# EAGLE design Firefly-Box (EAGLE 6.6.0)

## Sheet 1 of 3
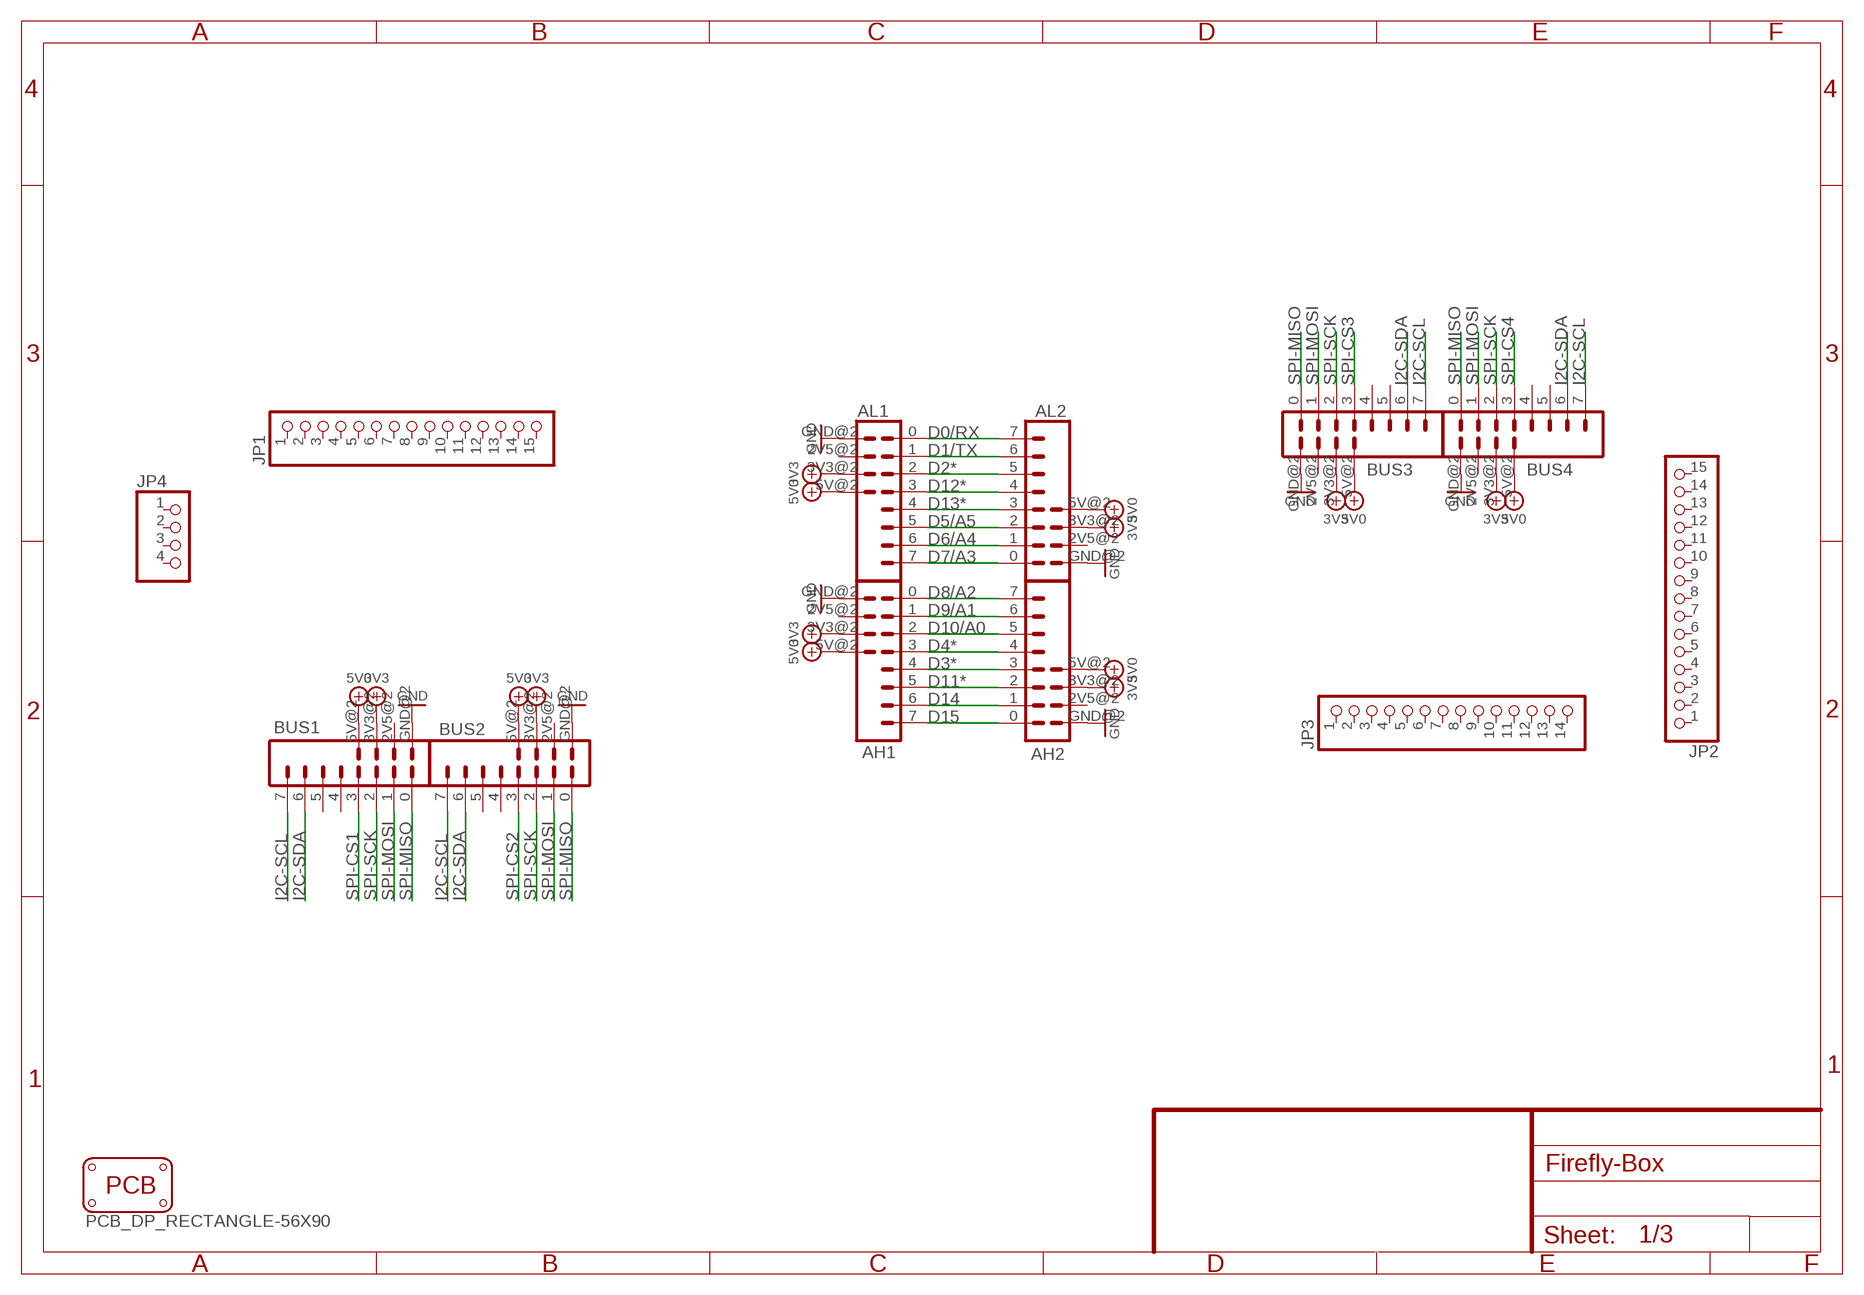
[diagram p0: schematic, sheet 1]

### Parts
AH1  WING8WING8_NOHOLES  [WINGSIDE_8BIT_NOHOLES]
AH2  WING8WING8_NOHOLES  [WINGSIDE_8BIT_NOHOLES]
AL1  WING8WING8_NOHOLES  [WINGSIDE_8BIT_NOHOLES]
AL2  WING8WING8_NOHOLES  [WINGSIDE_8BIT_NOHOLES]
BUS1  WING8WING8_NOHOLES  [WINGSIDE_8BIT_NOHOLES]
BUS2  WING8WING8_NOHOLES  [WINGSIDE_8BIT_NOHOLES]
BUS3  WING8WING8_NOHOLES  [WINGSIDE_8BIT_NOHOLES]
BUS4  WING8WING8_NOHOLES  [WINGSIDE_8BIT_NOHOLES]
JP1  PINHD-1X15  [1X15]
JP2  PINHD-1X15  [1X15]
JP3  PINHD-1X14  [1X14]
JP4  PINHD-1X4  [1X04]
PCB2  PCB_DP_RECTANGLE-56X90  [DP9056_V1]

### Nets
3V3: AH1.3V3@2(3V3) AH2.3V3@2(3V3) AL1.3V3@2(3V3) AL2.3V3@2(3V3) BUS1.3V3@2(3V3) BUS2.3V3@2(3V3) BUS3.3V3@2(3V3) BUS4.3V3@2(3V3) ; also sheet 2,3
5V0: AH1.5V@2(5V) AH2.5V@2(5V) AL1.5V@2(5V) AL2.5V@2(5V) BUS1.5V@2(5V) BUS2.5V@2(5V) BUS3.5V@2(5V) BUS4.5V@2(5V) ; also sheet 2,3
D0/RX: AL1.0 AL2.7 ; also sheet 2
D1/TX: AL1.1 AL2.6 ; also sheet 2
D2*: AL1.2 AL2.5 ; also sheet 2
D3*: AH1.4 AH2.3 ; also sheet 2
D4*: AH1.3 AH2.4 ; also sheet 2
D5/A5: AL1.5 AL2.2 ; also sheet 2
D6/A4: AL1.6 AL2.1 ; also sheet 2
D7/A3: AL1.7 AL2.0 ; also sheet 2
D8/A2: AH1.0 AH2.7 ; also sheet 2
D9/A1: AH1.1 AH2.6 ; also sheet 2
D10/A0: AH1.2 AH2.5 ; also sheet 2
D11*: AH1.5 AH2.2 ; also sheet 2
D12*: AL1.3 AL2.4 ; also sheet 2
D13*: AL1.4 AL2.3 ; also sheet 2
D14: AH1.6 AH2.1 ; also sheet 2
D15: AH1.7 AH2.0 ; also sheet 2
GND [gnd]: AH1.GND@2(GND) AH2.GND@2(GND) AL1.GND@2(GND) AL2.GND@2(GND) BUS1.GND@2(GND) BUS2.GND@2(GND) BUS3.GND@2(GND) BUS4.GND@2(GND) ; also sheet 2,3
I2C-SCL: BUS1.7 BUS2.7 BUS3.7 BUS4.7 ; also sheet 2
I2C-SDA: BUS1.6 BUS2.6 BUS3.6 BUS4.6 ; also sheet 2
SPI-CS1: BUS1.3 ; also sheet 2
SPI-CS2: BUS2.3 ; also sheet 2
SPI-CS3: BUS3.3 ; also sheet 2
SPI-CS4: BUS4.3 ; also sheet 2
SPI-MISO: BUS1.0 BUS2.0 BUS3.0 BUS4.0 ; also sheet 2
SPI-MOSI: BUS1.1 BUS2.1 BUS3.1 BUS4.1 ; also sheet 2
SPI-SCK: BUS1.2 BUS2.2 BUS3.2 BUS4.2 ; also sheet 2
Unconnected: AH1.2V5@2(2V5) AH2.2V5@2(2V5) AL1.2V5@2(2V5) AL2.2V5@2(2V5) BUS1.2V5@2(2V5) BUS1.4 BUS1.5 BUS2.2V5@2(2V5) BUS2.4 BUS2.5 BUS3.2V5@2(2V5) BUS3.4 BUS3.5 BUS4.2V5@2(2V5) BUS4.4 BUS4.5 JP1.1 JP1.2 JP1.3 JP1.4 JP1.5 JP1.6 JP1.7 JP1.8 JP1.9 JP1.10 JP1.11 JP1.12 JP1.13 JP1.14 JP1.15 JP2.1 JP2.2 JP2.3 JP2.4 JP2.5 JP2.6 JP2.7 JP2.8 JP2.9 JP2.10 JP2.11 JP2.12 JP2.13 JP2.14 JP2.15 JP3.1 JP3.2 JP3.3 JP3.4 JP3.5 JP3.6 JP3.7 JP3.8 JP3.9 JP3.10 JP3.11 JP3.12 JP3.13 JP3.14 JP4.1 JP4.2 JP4.3 JP4.4

## Sheet 2 of 3
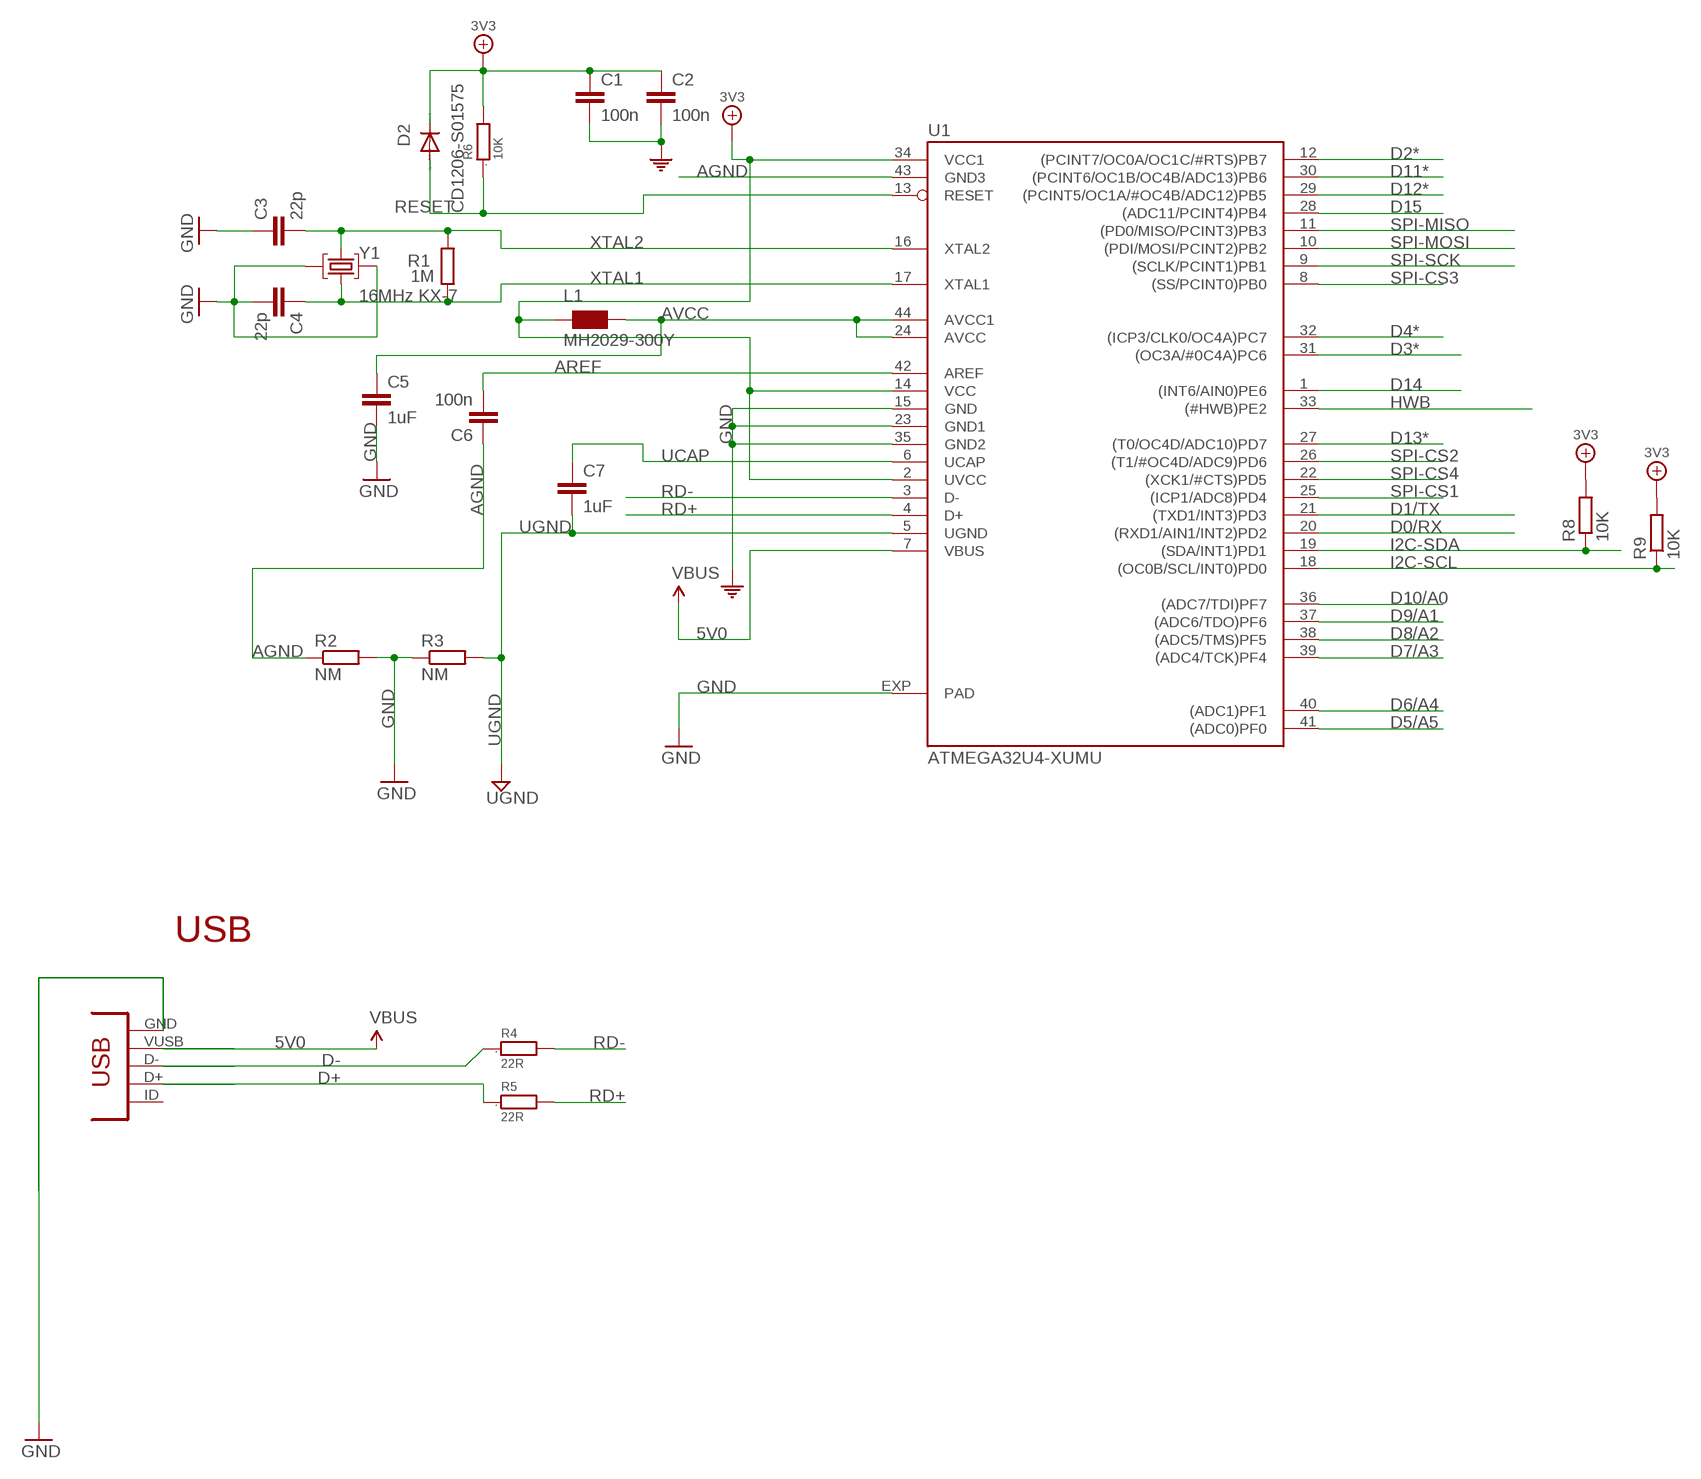
[diagram p1: schematic, sheet 2, part 1 of 2]
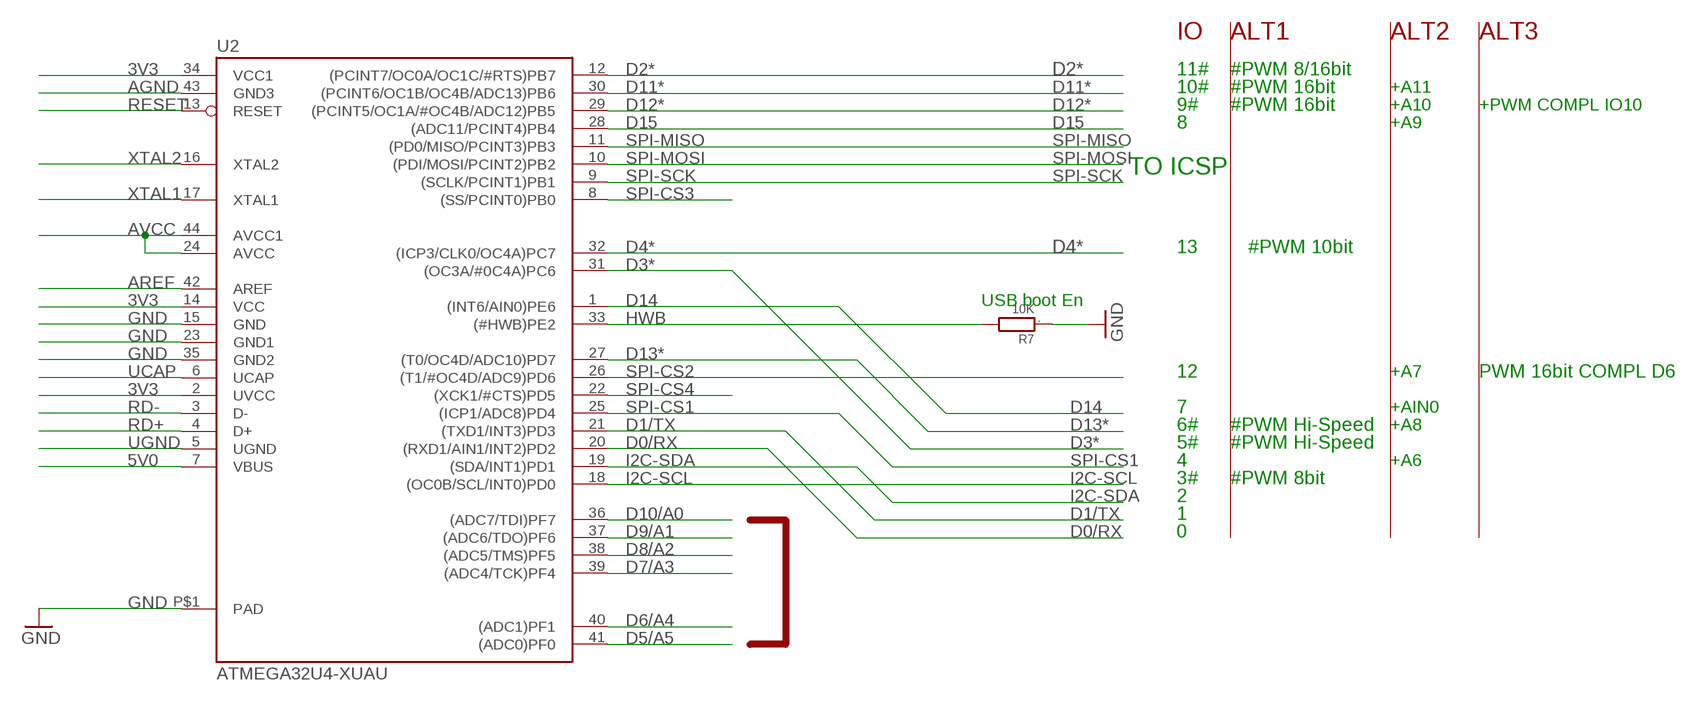
[diagram p2: schematic, sheet 2, part 2 of 2]

### Parts
C1  100n  C-EUC0603  [C0603-ROUND]
C2  100n  C-EUC0603  [C0603-ROUND]
C3  22p  C-EUC0603  [C0603-ROUND]
C4  22p  C-EUC0603  [C0603-ROUND]
C5  1uF  C-EUC0603  [C0603-ROUND]
C6  100n  C-EUC0603  [C0603-ROUND]
C7  1uF  C-EUC0603  [C0603-ROUND]
CONN2  CONN_USB  [CONN_USB_MINI-B]
D2  CD1206-S01575  DIODE-MINIMELF  [MINIMELF]
L1  MH2029-300Y  WE-CBF_0805  [0805]
R1  1M  R-EU_R0603  [R0603-ROUND]
R2  NM  R-EU_R0402  [R0402]
R3  NM  R-EU_R0402  [R0402]
R4  22R  R0805  [0805]
R5  22R  R0805  [0805]
R6  10K  R0805  [0805]
R7  10K  R0805  [0805]
R8  10K  R-EU_R0402  [R0402]
R9  10K  R-EU_R0402  [R0402]
U1  ATMEGA32U4-XUMU  [QFN44ML7X7]
U2  ATMEGA32U4-XUAU  [TQFP44-PAD]
Y1  16MHz KX-7  CRYSTAL-3.2-2.5  [CRYSTAL-3.2-2.5]

### Nets
3V3: C1.1 C2.1 D2.C L1.1 R6.2 R8.2 R9.2 U1.2(UVCC) U1.14(VCC) U1.34(VCC1) U2.2(UVCC) U2.14(VCC) U2.34(VCC1) ; also sheet 1,3
5V0: CONN2.VUSB U1.7(VBUS) U2.7(VBUS) ; supply symbol labelled VBUS ; also sheet 1,3
AGND: C6.1 R2.1 U1.43(GND3) U2.43(GND3)
AREF [aref]: C6.2 U1.42(AREF) U2.42(AREF)
AVCC: C5.1 L1.2 U1.24(AVCC) U1.44(AVCC1) U2.24(AVCC) U2.44(AVCC1)
D0/RX: U1.20((RXD1/AIN1/INT2)PD2) U2.20((RXD1/AIN1/INT2)PD2) ; also sheet 1
D1/TX: U1.21((TXD1/INT3)PD3) U2.21((TXD1/INT3)PD3) ; also sheet 1
D2*: U1.12((PCINT7/OC0A/OC1C/#RTS)PB7) U2.12((PCINT7/OC0A/OC1C/#RTS)PB7) ; also sheet 1
D3*: U1.31((OC3A/#0C4A)PC6) U2.31((OC3A/#0C4A)PC6) ; also sheet 1
D4*: U1.32((ICP3/CLK0/OC4A)PC7) U2.32((ICP3/CLK0/OC4A)PC7) ; also sheet 1
D5/A5: U1.41((ADC0)PF0) U2.41((ADC0)PF0) ; also sheet 1
D6/A4: U1.40((ADC1)PF1) U2.40((ADC1)PF1) ; also sheet 1
D7/A3: U1.39((ADC4/TCK)PF4) U2.39((ADC4/TCK)PF4) ; also sheet 1
D8/A2: U1.38((ADC5/TMS)PF5) U2.38((ADC5/TMS)PF5) ; also sheet 1
D9/A1: U1.37((ADC6/TDO)PF6) U2.37((ADC6/TDO)PF6) ; also sheet 1
D10/A0: U1.36((ADC7/TDI)PF7) U2.36((ADC7/TDI)PF7) ; also sheet 1
D11*: U1.30((PCINT6/OC1B/OC4B/ADC13)PB6) U2.30((PCINT6/OC1B/OC4B/ADC13)PB6) ; also sheet 1
D12*: U1.29((PCINT5/OC1A/#OC4B/ADC12)PB5) U2.29((PCINT5/OC1A/#OC4B/ADC12)PB5) ; also sheet 1
D13*: U1.27((T0/OC4D/ADC10)PD7) U2.27((T0/OC4D/ADC10)PD7) ; also sheet 1
D14: U1.1((INT6/AIN0)PE6) U2.1((INT6/AIN0)PE6) ; also sheet 1
D15: U1.28((ADC11/PCINT4)PB4) U2.28((ADC11/PCINT4)PB4) ; also sheet 1
D+: CONN2.D+ R5.1
D-: CONN2.D- R4.1
GND [gnd]: C1.2 C2.2 C3.1 C4.2 C5.2 CONN2.GND R2.2 R3.1 R7.1 U1.15(GND) U1.23(GND1) U1.35(GND2) U1.EXP(PAD) U2.15(GND) U2.23(GND1) U2.35(GND2) U2.P$1(PAD) Y1.2(GND) Y1.4(GND) ; supply symbol labelled COM ; also sheet 1,3
HWB: R7.2 U1.33((#HWB)PE2) U2.33((#HWB)PE2)
I2C-SCL: R9.1 U1.18((OC0B/SCL/INT0)PD0) U2.18((OC0B/SCL/INT0)PD0) ; also sheet 1
I2C-SDA: R8.1 U1.19((SDA/INT1)PD1) U2.19((SDA/INT1)PD1) ; also sheet 1
RD+: R5.2 U1.4(D+) U2.4(D+)
RD-: R4.2 U1.3(D-) U2.3(D-)
RESET: D2.A R6.1 U1.13(RESET) U2.13(RESET)
SPI-CS1: U1.25((ICP1/ADC8)PD4) U2.25((ICP1/ADC8)PD4) ; also sheet 1
SPI-CS2: U1.26((T1/#OC4D/ADC9)PD6) U2.26((T1/#OC4D/ADC9)PD6) ; also sheet 1
SPI-CS3: U1.8((SS/PCINT0)PB0) U2.8((SS/PCINT0)PB0) ; also sheet 1
SPI-CS4: U1.22((XCK1/#CTS)PD5) U2.22((XCK1/#CTS)PD5) ; also sheet 1
SPI-MISO: U1.11((PD0/MISO/PCINT3)PB3) U2.11((PD0/MISO/PCINT3)PB3) ; also sheet 1
SPI-MOSI: U1.10((PDI/MOSI/PCINT2)PB2) U2.10((PDI/MOSI/PCINT2)PB2) ; also sheet 1
SPI-SCK: U1.9((SCLK/PCINT1)PB1) U2.9((SCLK/PCINT1)PB1) ; also sheet 1
UCAP: C7.1 U1.6(UCAP) U2.6(UCAP)
UGND [gnd]: C7.2 R3.2 U1.5(UGND) U2.5(UGND)
XTAL1: C4.1 R1.1 U1.17(XTAL1) U2.17(XTAL1) Y1.1(C1)
XTAL2: C3.2 R1.2 U1.16(XTAL2) U2.16(XTAL2) Y1.3(C2)
Unconnected: CONN2.BODY@1(BODY) CONN2.BODY@2(BODY) CONN2.BODY@3(BODY) CONN2.BODY@4(BODY) CONN2.ID(USBID)

### Notes on the sheet
- IO | ALT1 | ALT2 | ALT3
- 11# | #PWM 8/16bit
- 10# | #PWM 16bit | +A11
- 9# | #PWM 16bit | +A10 | +PWM COMPL IO10
- 8 | +A9
- TO ICSP
- 13 | #PWM 10bit
- USB boot En
- 12 | +A7 | PWM 16bit COMPL D6
- 7 | +AIN0
- 6# | #PWM Hi-Speed | +A8
- 5# | #PWM Hi-Speed
- 4 | +A6
- 3# | #PWM 8bit
- 2
- 1
- 0
- USB

## Sheet 3 of 3
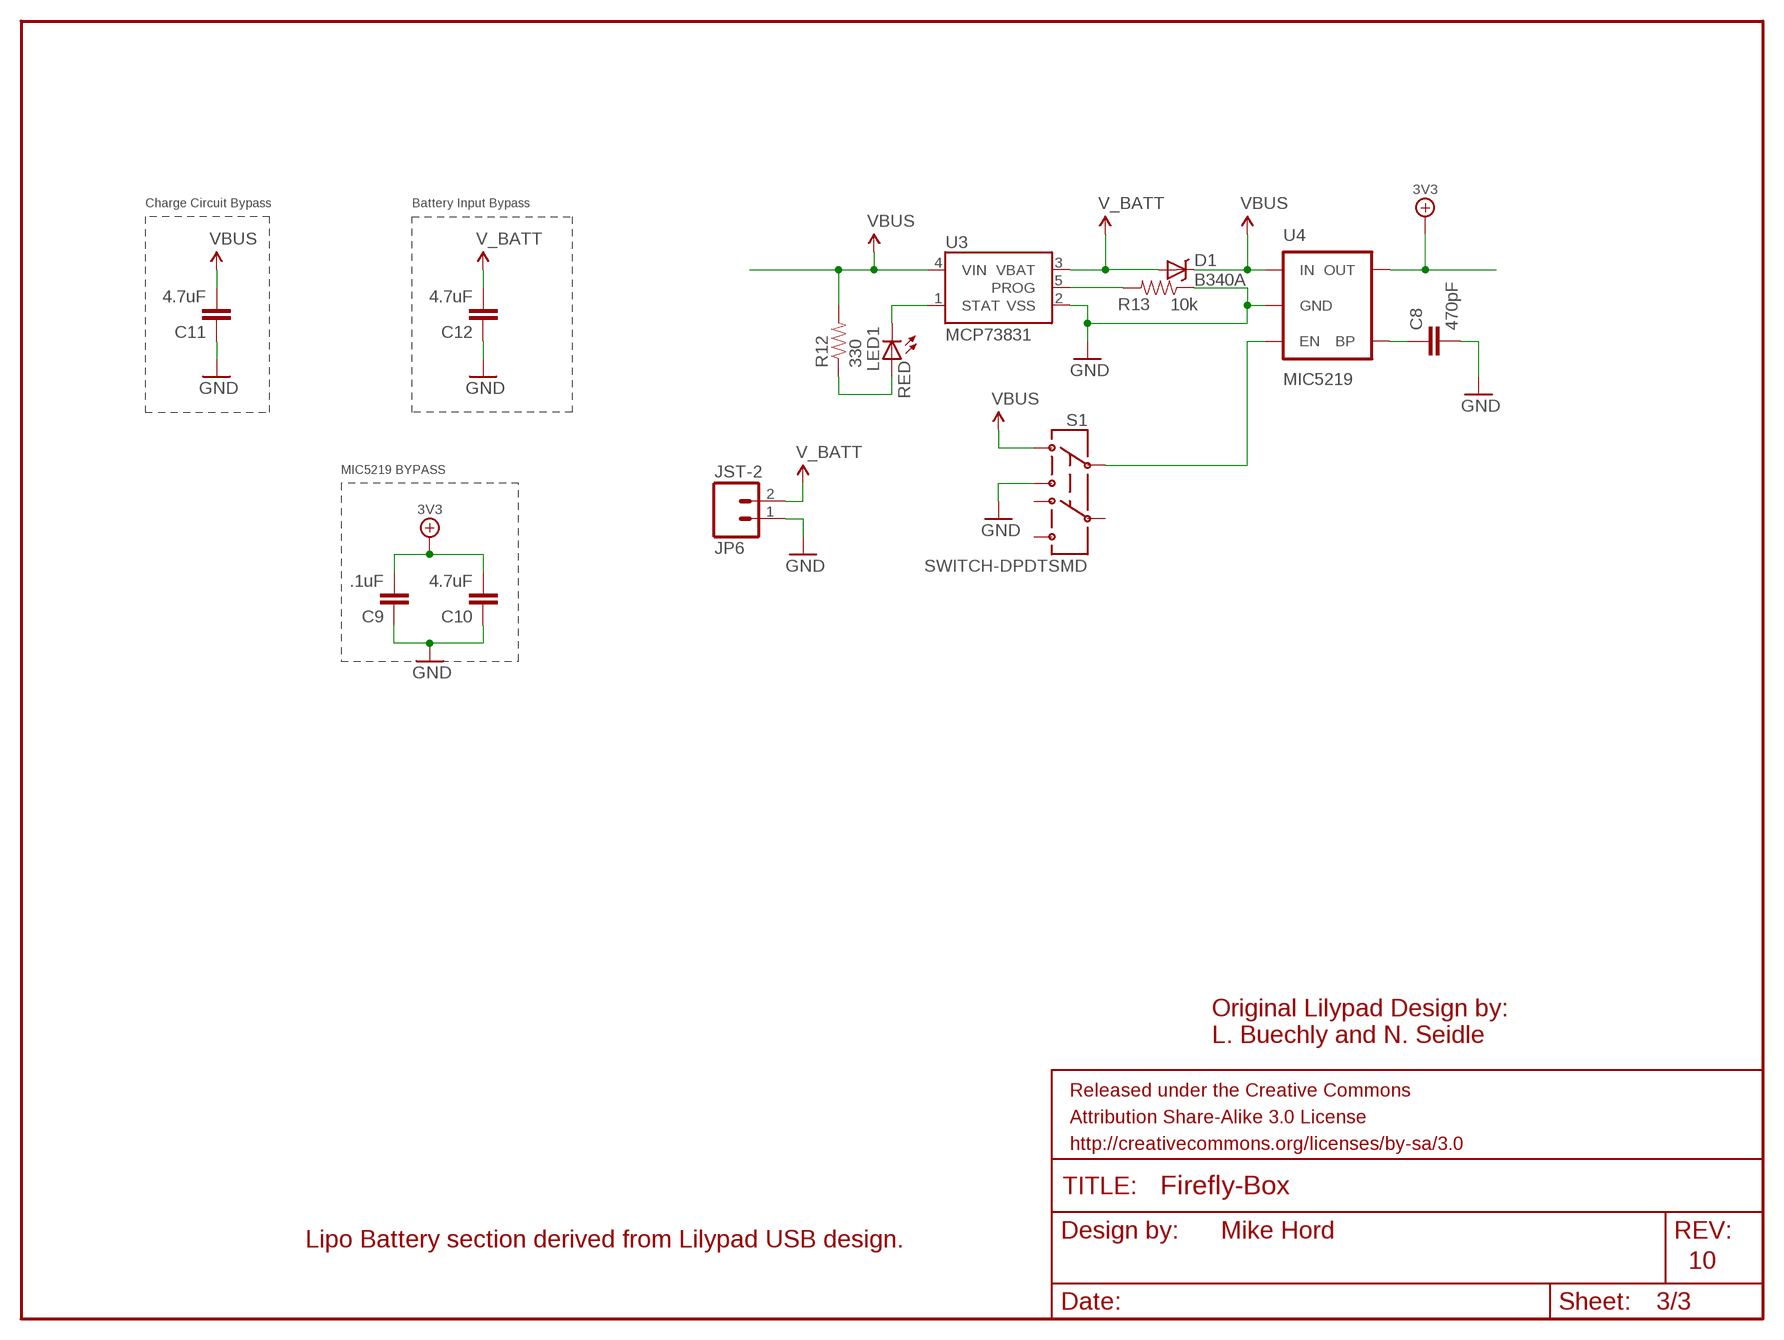
[diagram p3: schematic, sheet 3]

### Parts
C8  470pF  CAP0603-CAP  [0603-CAP]
C9  .1uF  CAP0603-CAP  [0603-CAP]
C10  4.7uF  CAP0603-CAP  [0603-CAP]
C11  4.7uF  CAP1206  [1206]
C12  4.7uF  CAP1206  [1206]
D1  B340A  DIODE-SCHOTTKY_  [SMA-DIODE]
JP6  JST-2  M02-JST-2MM-SMT  [JST-2-SMD]
LED1  RED  LED0603  [LED-0603]
R12  330  RESISTOR0603-RES  [0603-RES]
R13  10k  RESISTOR0603-RES  [0603-RES]
S1  SWITCH-DPDTSMD  [AYZ0202]
U3  MCP73831  [SOT23-5]
U4  MIC5219  V_REG_MIC5219SMD  [SOT23-5]

### Nets
3V3: C9.2 C10.2 U4.5(OUT) ; also sheet 1,2
5V0: C11.2 D1.C R12.2 S1.1 U3.4(VIN) U4.1(IN) ; supply symbol labelled VBUS ; also sheet 1,2
GND [gnd]: C8.2 C9.1 C10.1 C11.1 C12.1 JP6.1 R13.1 S1.3 U3.2(VSS) U4.2(GND) ; also sheet 1,2
N$1: S1.2 U4.3(EN)
N$4: LED1.A R12.1
N$5: LED1.C U3.1(STAT)
N$6: R13.2 U3.5(PROG)
N$8: C8.1 U4.4(BP)
V_BATT: C12.2 D1.A JP6.2 U3.3(VBAT)
Unconnected: S1.4 S1.5 S1.6

### Notes on the sheet
- Charge Circuit Bypass | Battery Input Bypass
- MIC5219 BYPASS
- Original Lilypad Design by:
- L. Buechly and N. Seidle
- Mike Hord
- Lipo Battery section derived from Lilypad USB design.
- 10

## Library data of the parts
AH1 AH2 AL1 AL2 BUS1-BUS4 = Papilio:WING8
C1-C7 = SmartPrj:C-EU: CAPACITOR, European symbol
C8 = SparkFun-Passives:CAP: Capacitor Standard 0603 ceramic capacitor, and 0.1" leaded capacitor.; PROD_ID: CAP-07884
C9 = SparkFun-Passives:CAP: Capacitor Standard 0603 ceramic capacitor, and 0.1" leaded capacitor.; PROD_ID: CAP-00810
C10 = SparkFun-Passives:CAP: Capacitor Standard 0603 ceramic capacitor, and 0.1" leaded capacitor.; PROD_ID: CAP-08280
C11 C12 = SparkFun-Passives:CAP: Capacitor Standard 0603 ceramic capacitor, and 0.1" leaded capacitor.; PROD_ID: CAP-10300
CONN2 = dp_devices:CONN_USB: USB connector
D1 = SparkFun-DiscreteSemi:DIODE-SCHOTTKY: Commonly MBRA140.; PROD_ID: DIO-09886
D2 = diode:DIODE-: DIODE
JP1 JP2 = pinhead:PINHD-1X15: PIN HEADER
JP3 = pinhead:PINHD-1X14: PIN HEADER
JP4 = pinhead:PINHD-1X4: PIN HEADER
JP6 = SparkFun-Connectors:M02: Header 2 Standard 2-pin 0.1" header. Use with straight break away headers (SKU : PRT-00116), right angle break away headers (PRT-00553), swiss pins (PRT-00743), machine pins (PRT-00117), and female headers (PRT-00115). Molex polarized connector foot print use with SKU : PRT-08233 with associated crimp pins and housings.; PROD_ID: CONN-08352
L1 = wuerth-elektronik:WE-CBF: SMD EMI Suppression Ferrite Beads - excellent anti-EMI properties - low DCR - impedances till 3000 ohms - rated current up to 6 A
LED1 = SparkFun-LED:LED: LEDs Standard schematic elements and footprints for 5mm, 3mm, 1206, and 0603 sized LEDs. 5mm - Spark Fun Electronics SKU : COM-00529 (and others); PROD_ID: DIO-00819
PCB2 = dp_pcb:PCB_DP_RECTANGLE: Dangerous Prototypes Standard Rectangular PCB sizes
R1-R3 R8 R9 = SmartPrj:R-EU_: RESISTOR, European symbol
R4-R7 = GadgetFactory_6.0:R: RESISTOR, European symbol
R12 = SparkFun-Passives:RESISTOR: Resistor Basic schematic elements and footprints for 0603, 1206, and PTH resistors.; PROD_ID: RES-00818
R13 = SparkFun-Passives:RESISTOR: Resistor Basic schematic elements and footprints for 0603, 1206, and PTH resistors.; PROD_ID: RES-00824
S1 = SparkFun-Electromechanical:SWITCH-DPDT: DPDT Version of the COM-00597; PROD_ID: SWCH-08179
U1 U2 = SmartPrj:ATMEGA32U4-XU
U3 = SparkFun-PowerIC:MCP73831: Miniature single cell, fully integrated Li-Ion, Li-polymer charge management controller http://ww1.microchip.com/downloads/en/DeviceDoc/21984a.pdf; PROD_ID: IC-09995
U4 = SparkFun-PowerIC:V_REG_MIC5219: V_REG MIC5219 Standard 500mA LDO voltage regulator in SOT-23 layout. Micrel part MIC5219. BP (by-pass) pin is used to lower output noise with 470pF cap, may be left open.; PROD_ID: VREG-09872
Y1 = SmartPrj:CRYSTAL-3.2-2.5

## Net classes
0 default: width 0.254 mm, drill 0.381 mm, clearance 0.254 mm
2 gnd: width 0.254 mm, drill 0.381 mm, clearance 0.254 mm
3 usbvcc: width 0.254 mm, drill 0.381 mm, clearance 0.254 mm
4 aref: width 0.254 mm, drill 0.381 mm, clearance 0.254 mm

## Board
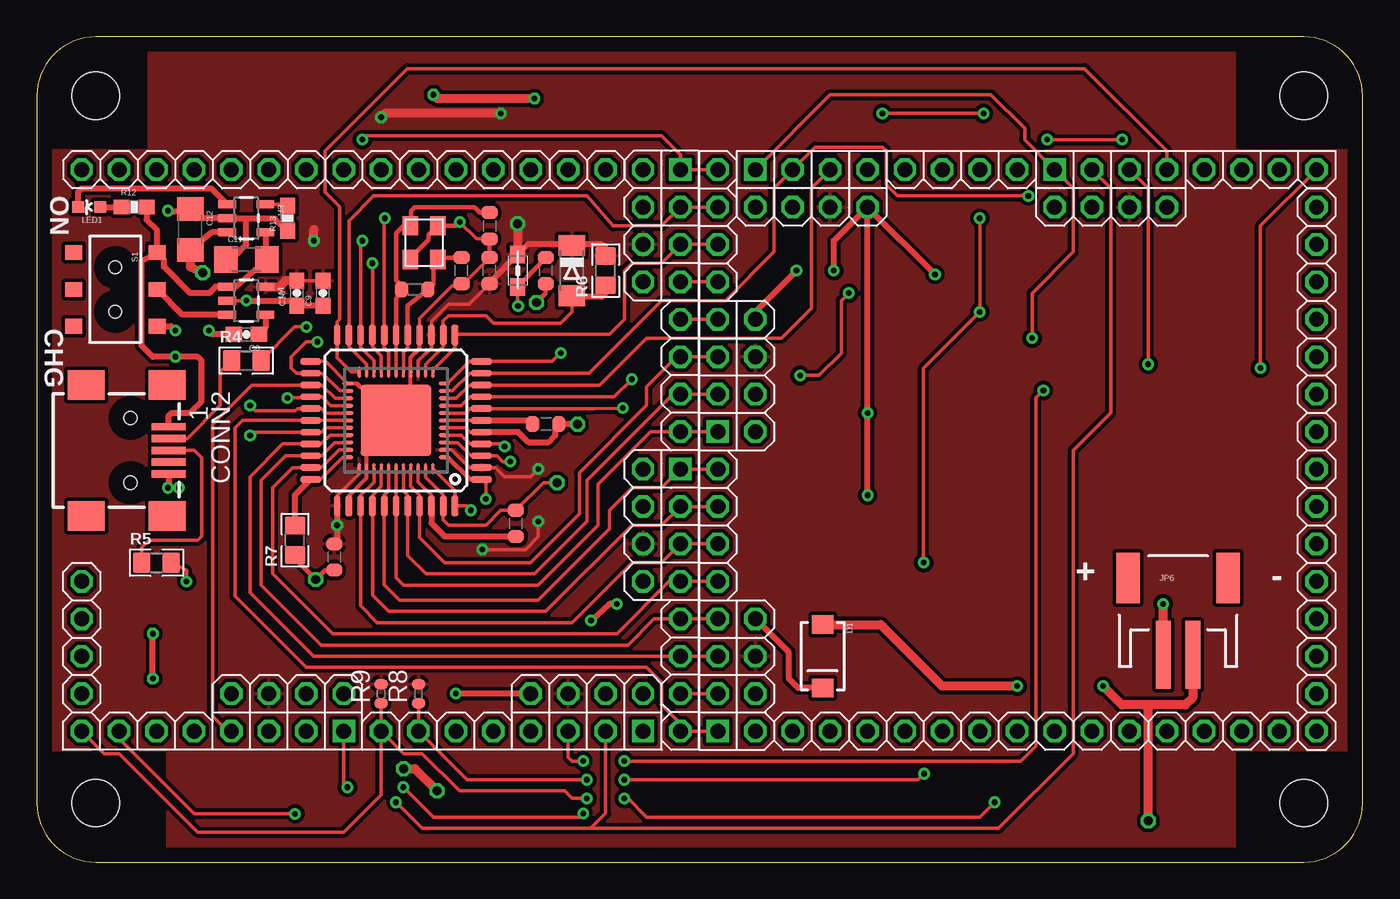
[diagram p4: board, top side]
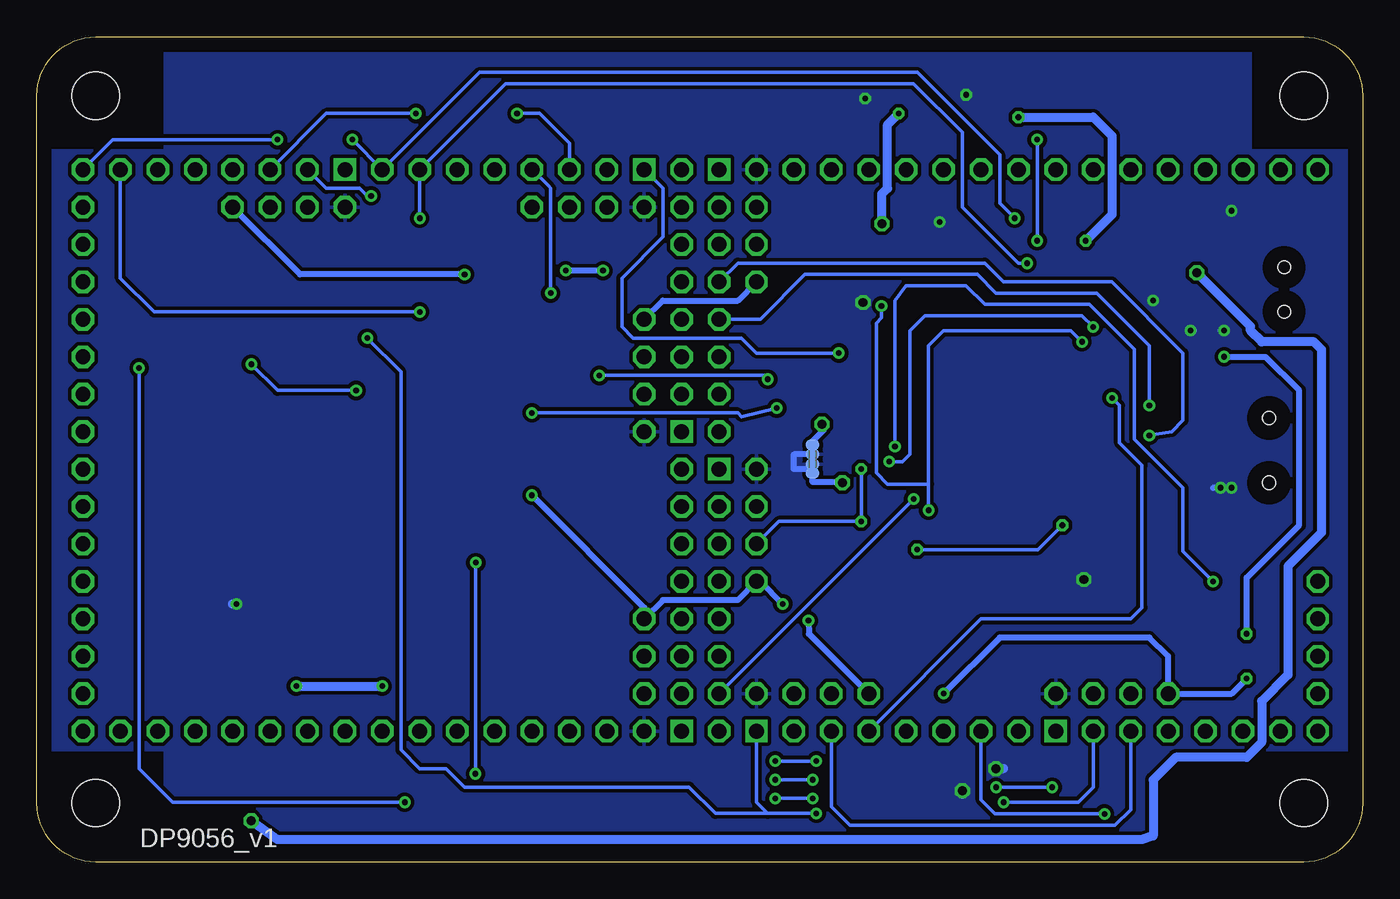
[diagram p5: board, bottom side, seen from below]

Size 90 x 56 mm. Coordinates in mm from the lower left corner, seen from the top.
Copper layers (1*16): Top 0.035mm / dielectric 1.5mm / Bottom 0.035mm
Design rules "default *": minimum track width 10mil, minimum drill 15mil, track to track 8mil, track to pad 8mil, pad to pad 8mil, via to via 8mil, smd to smd 8mil, copper to edge 40mil, drill to drill 8mil, minimum pad ring 10mil, minimum via ring 8mil, stop-mask expansion 4mil, vias tented up to drill 0mil, thermal gap 10mil

### Footprints (pad centres in the part's own frame; a part is rotated, then mirrored left to right if it is on the bottom)
WINGSIDE_8BIT_NOHOLES = drill 1.016 square: 0 19.05,1.27 | drill 1.016 octagon: 1 16.51,1.27; 2 13.97,1.27; 2V5@2 16.51,3.81; 3 11.43,1.27; 3V3@2 13.97,3.81; 4 8.89,1.27; 5 6.35,1.27; 5V@2 11.43,3.81; 6 3.81,1.27; 7 1.27,1.27; GND@2 19.05,3.81
C0603-ROUND = smd 0.898 x 1.1: 1 -0.889,0; 2 0.889,0
0603-CAP = smd 1.1 x 1: 1 -0.85,0; 2 0.85,0
1206 = smd 1.6 x 1.8: 1 -1.4,0; 2 1.4,0
CONN_USB_MINI-B = smd 2 x 2.5: BODY@1 -4.45,2.5; BODY@2 4.45,2.5; BODY@3 4.45,-3; BODY@4 -4.45,-3 | smd 0.5 x 2.3: D+ 0,2.6; D- -0.8,2.6; GND 1.6,2.6; ID 0.8,2.6; VUSB -1.6,2.6 | hole 0.9: -2.2,0; 2.2,0
SMA-DIODE = smd 1.27 x 1.47: A -2.15,0; C 2.15,0
MINIMELF = smd 1.4 x 1.8: A 1.7,0; C -1.7,0
1X15 = drill 1.016 octagon: 1 -17.78,0; 2 -15.24,0; 3 -12.7,0; 4 -10.16,0; 5 -7.62,0; 6 -5.08,0; 7 -2.54,0; 8 0,0; 9 2.54,0; 10 5.08,0; 11 7.62,0; 12 10.16,0; 13 12.7,0; 14 15.24,0; 15 17.78,0
1X14 = drill 1.016 octagon: 1 -16.51,0; 2 -13.97,0; 3 -11.43,0; 4 -8.89,0; 5 -6.35,0; 6 -3.81,0; 7 -1.27,0; 8 1.27,0; 9 3.81,0; 10 6.35,0; 11 8.89,0; 12 11.43,0; 13 13.97,0; 14 16.51,0
1X04 = drill 1.016 octagon: 1 -3.81,0; 2 -1.27,0; 3 1.27,0; 4 3.81,0
JST-2-SMD = smd 1 x 4.6: 1 -1,-3.7; 2 1,-3.7 | smd 1.6 x 3.4: NC1 -3.4,1.5; NC2 3.4,1.5
0805 = smd 1.2 x 1: 1 -1.1,0; 2 1.1,0
LED-0603 = smd 0.8 x 0.8: A 0,-0.75; C 0,0.75
DP9056_V1 = hole 3.2: 4,4; 86,4; 86,52; 4,52
R0603-ROUND = smd 0.898 x 1.1: 1 -0.889,0; 2 0.889,0
R0402 = smd 0.7 x 0.9: 1 -0.65,0; 2 0.65,0
0805' = smd 1.2 x 1.4: 1 -1,0; 2 1,0
0603-RES = smd 1.1 x 1: 1 -0.85,0; 2 0.85,0
AYZ0202 = smd 1 x 1.15: 1 -2.5,2.825; 2 0,2.825; 3 2.5,2.825; 4 -2.5,-2.825; 5 0,-2.825; 6 2.5,-2.825 | hole 0.85: 1.5,0; -1.5,0
QFN44ML7X7 = smd 0.75 x 0.275: 1 -3.275,2.5; 2 -3.275,2; 3 -3.275,1.5; 4 -3.275,1; 5 -3.275,0.5; 6 -3.275,0; 7 -3.275,-0.5; 8 -3.275,-1; 9 -3.275,-1.5; 10 -3.275,-2; 11 -3.275,-2.5; 23 3.275,-2.5; 24 3.275,-2; 25 3.275,-1.5; 26 3.275,-1; 27 3.275,-0.5; 28 3.275,0; 29 3.275,0.5; 30 3.275,1; 31 3.275,1.5; 32 3.275,2; 33 3.275,2.5 | smd 0.275 x 0.75: 12 -2.5,-3.275; 13 -2,-3.275; 14 -1.5,-3.275; 15 -1,-3.275; 16 -0.5,-3.275; 17 0,-3.275; 18 0.5,-3.275; 19 1,-3.275; 20 1.5,-3.275; 21 2,-3.275; 22 2.5,-3.275; 34 2.5,3.275; 35 2,3.275; 36 1.5,3.275; 37 1,3.275; 38 0.5,3.275; 39 0,3.275; 40 -0.5,3.275; 41 -1,3.275; 42 -1.5,3.275; 43 -2,3.275; 44 -2.5,3.275 | smd 4.826 x 4.826: EXP 0,0
TQFP44-PAD = smd 1.4 x 0.45: 1 -5.8,4; 2 -5.8,3.2; 3 -5.8,2.4; 4 -5.8,1.6; 5 -5.8,0.8; 6 -5.8,0; 7 -5.8,-0.8; 8 -5.8,-1.6; 9 -5.8,-2.4; 10 -5.8,-3.2; 11 -5.8,-4; 23 5.8,-4; 24 5.8,-3.2; 25 5.8,-2.4; 26 5.8,-1.6; 27 5.8,-0.8; 28 5.8,0; 29 5.8,0.8; 30 5.8,1.6; 31 5.8,2.4; 32 5.8,3.2; 33 5.8,4 | smd 0.45 x 1.4: 12 -4,-5.8; 13 -3.2,-5.8; 14 -2.4,-5.8; 15 -1.6,-5.8; 16 -0.8,-5.8; 17 0,-5.8; 18 0.8,-5.8; 19 1.6,-5.8; 20 2.4,-5.8; 21 3.2,-5.8; 22 4,-5.8; 34 4,5.8; 35 3.2,5.8; 36 2.4,5.8; 37 1.6,5.8; 38 0.8,5.8; 39 0,5.8; 40 -0.8,5.8; 41 -1.6,5.8; 42 -2.4,5.8; 43 -3.2,5.8; 44 -4,5.8 | smd 1 x 1: P$1 0,0
SOT23-5 = smd 0.55 x 1.2: 1 -0.95,-1.3; 2 0,-1.3; 3 0.95,-1.3; 4 0.95,1.3; 5 -0.95,1.3
CRYSTAL-3.2-2.5 = smd 1.3 x 1.05: 1 -1.15,-0.925; 2 1.15,-0.925; 3 1.15,0.925; 4 -1.15,0.925

### Placement (x,y rotation side)
AH1  44.96,7.62 90 top
AH2  44.96,27.94 270 top
AL1  44.96,27.94 90 top
AL2  44.96,48.26 270 top
BUS1  1.78,7.62 0 top
BUS2  22.1,7.62 0 top
BUS3  67.82,48.26 180 top
BUS4  88.14,48.26 180 top
C1  20.19,20.7 270 top
C2  30.73,40.13 90 top
C3  28.83,40.13 90 top
C4  30.73,43.18 270 top
C5  34.54,40.13 270 top
C6  32.51,22.99 270 top
C7  34.54,29.72 0 top
C8  14.22,35.81 180 top
C9  19.43,38.61 90 top
C10  17.65,38.61 90 top
C11  14.22,40.89 0 top
C12  10.41,42.93 270 top
CONN2  6.35,27.94 270 top
D1  53.34,13.97 270 top
D2  36.32,40.13 270 top
JP1  20.83,46.99 0 top
JP2  86.87,26.67 90 top
JP3  67.82,8.89 0 top
JP4  3.05,15.24 90 top
JP6  77.47,17.78 0 top
L1  32.64,40.13 270 top
LED1  3.56,44.45 90 top
PCB2  0,0 0 top
R1  25.65,38.86 0 top
R2  37.34,27.03 90 bottom
R3  37.34,27.66 90 bottom
R4  22R  [0805']  14.22,34.04 0 top
R5  22R  [0805']  8.13,20.32 0 top
R6  10K  [0805']  38.61,40.13 90 top
R7  10K  [0805']  17.53,21.84 90 top
R8  25.91,11.43 90 top
R9  23.37,11.43 90 top
R12  6.6,44.45 0 top
R13  17.02,43.69 90 top
S1  5.33,38.86 270 top
U1  24.38,29.97 180 top
U2  24.38,29.97 180 top
U3  14.22,43.69 270 top
U4  14.22,38.1 270 top
Y1  26.29,42.04 270 top

### Tracks (layer width: path | path; a pad name or v marks a point on that pad's centre or on a via)
3V3  (via drill 0.38, 0.61)
  Top 0.254: U2.34 20.38,24.85 21.88,26.35 | U1.2 28.16,27.97 29.36,26.77 U2.2 31.14,26.77 31.75,26.16 33.53,26.16 v34.04,26.67 | U1.14 25.88,34.01 26.78,34.91 U2.14 26.78,36.69 27.94,37.85 29.34,37.85 C2.1 | C10.2 C9.2 | v34.04,23.11 34.04,22.07 33.17,21.21 v30.25,21.21
  Top 0.406: C2.1 30.89,39.4 30.89,39.48 L1.1 33.37,41.96 36.15,41.96 36.2,41.91 36.24,41.91 D2.C 36.4,41.91 38.35,41.91 38.61,41.66 R6.2 | U2.34 v20.38,22.86 20.38,21.78 C1.1
  Top 0.61: v32.64,43.31 L1.1 | v31.5,50.8 23.62,50.8 v23.37,50.55 | v18.8,42.16 18.8,42.93 | U4.5 16.47,39.05 16.88,39.46 C10.2
  Bottom 0.254: v34.04,26.67 v34.04,23.11 39.62,23.11 AH1.3V3@2 | v30.25,21.21 22.04,21.21 v20.38,22.86
  Bottom 0.61: v32.64,43.31 32.64,45.34 32.26,45.72 32.26,50.04 v31.5,50.8 | v23.37,50.55 18.29,50.55 17.02,49.28 17.02,43.94 v18.8,42.16
  pour Top: 0,7.62 0,48.26 7.62,48.26 7.62,55.88 81.28,55.88 81.28,48.26 90.17,48.26 90.17,7.62 81.28,7.62 81.28,0 8.89,0 8.89,7.62
5V0  (via drill 0.38)
  Top 0.254: U1.7 29.13,30.47 29.43,30.77 U2.7 37.81,30.77 v39.78,30.81
  Top 0.406: CONN2.VUSB 8.95,30.29 9.14,30.48 10.41,30.48 11.18,31.24 11.18,34.04 10.92,34.29 v9.4,34.29 7.87,34.29 7.11,35.05 7.11,40.82 S1.1 | S1.1 8.16,42.9 7.45,43.6 R12.2 | S1.1 8.64,40.88 8.64,40.39 10.41,38.61 11.68,38.61 12.13,39.05 U4.1 13.53,39.05 C11.2 15.52,41.25 U3.4 | BUS3.5V@2 v60.96,39.88 | AL2.5V@2 48.77,37.34 v51.56,40.13 | v54.1,40.13 54.1,42.16 BUS3.5V@2 | D1.C 51.68,11.82 51.05,12.45 51.05,14.22 AH2.5V@2 | BUS2.5V@2 v28.45,11.43 | v39.37,17.53 38.86,17.53 v37.62,16.38 | v56.39,24.89 v56.39,30.48 BUS3.5V@2 | v7.87,12.45 v7.87,15.49
  Bottom 0.254: v39.78,30.81 42.16,30.23 42.42,30.48 v56.39,30.48
  Bottom 0.406: v60.96,39.88 72.14,39.88 BUS4.5V@2 | AL2.5V@2 47.5,38.1 42.42,38.1 AL1.5V@2 | v51.56,40.13 v54.1,40.13 | v28.45,11.43 24.64,15.24 14.48,15.24 13.21,13.97 BUS1.5V@2 8.89,11.43 v7.87,12.45 | v39.37,17.53 40.89,19.05 AH1.5V@2 42.42,17.78 47.5,17.78 AH2.5V@2 48.77,17.27 v56.39,24.89 | v37.62,16.38 37.59,15.49 BUS2.5V@2 | v9.4,34.29 6.6,34.29 4.32,32 4.32,22.86 7.87,19.3 v7.87,15.49
AGND  (via drill 0.61)
  Top 0.254: U1.43 26.38,26.12 27.58,24.92 U2.43 27.58,23.22 27.94,22.86 30.48,22.86 31.5,23.88 C6.1 34.39,25.76 v35.31,25.76
  Bottom 0.406: v35.31,25.76 35.31,25.78 37.34,25.78 R2.1
AREF
  Top 0.254: U1.42 25.88,25.78 26.78,24.88 U2.42
  Top 0.406: U2.42 26.78,23 27.69,22.1 C6.2
AVCC  (via drill 0.38)
  Top 0.254: U1.24 20.96,31.98 20.57,31.98 19.41,33.15 18.61,33.15 U2.24 17.63,33.17 17.27,33.53 17.27,34.29 18.29,35.31 v19.05,35.31 | U1.44 26.9,26.7 28.38,25.21 U2.44 29.17,24.17 v29.46,23.88 | L1.2 32.64,37.77 v32.66,37.74
  Top 0.305: L1.2 33.09,39.48 C5.1
  Bottom 0.254: v29.46,23.88 29.46,25.65 | 29.46,25.65 29.46,35.05 28.45,36.07 19.81,36.07 v19.05,35.31 | v32.66,37.74 32.66,36.93 33.02,36.58 33.02,26.42 32.26,25.65 29.46,25.65
D0/RX  (via drill 0.38)
  Top 0.254: U1.20 22.88,34.04 21.98,34.94 U2.20 21.98,42.05 v22.1,42.16 | v22.1,49.02 22.35,49.28 42.42,49.28 43.69,48.01 AL1.0 AL2.7
  Bottom 0.254: v22.1,49.02 22.1,42.67 v22.1,42.16
D1/TX
  Top 0.254: U1.21 22.38,33.77 21.18,34.98 U2.21 21.18,43.54 22.86,45.21 37.34,45.21 39.12,43.18 42.42,43.18 AL1.1 AL2.6
D2*
  Top 0.254: U1.12 26.88,33.41 28.38,34.91 U2.12 28.43,35.81 38.86,35.81 39.88,36.83 39.88,40.13 40.39,40.64 42.42,40.64 AL1.2 AL2.5
D3*
  Top 0.254: U1.31 20.22,28.47 19.32,27.57 U2.31 16.9,27.57 15.24,25.91 15.24,18.8 19.3,14.73 40.13,14.73 41.91,16.51 AH1.4 AH2.3
D4*
  Top 0.254: AH2.4 AH1.3 42.93,19.05 39.37,15.49 20.07,15.49 16,19.56 16,25.4 17.37,26.77 U2.32 19.3,26.77 20.5,27.97 U1.32
D5/A5
  Top 0.254: U1.41 25.38,25.49 25.98,24.89 U2.41 25.98,22.02 27.69,20.32 33.53,20.32 36.83,23.62 36.83,26.42 41.4,30.99 41.4,32.26 43.43,34.29 AL1.5 AL2.2
D6/A4
  Top 0.254: U1.40 24.88,25.2 25.18,24.91 U2.40 25.18,20.79 26.42,19.56 33.78,19.56 37.34,23.11 37.34,25.91 43.18,31.75 AL1.6 AL2.1
D7/A3
  Top 0.254: U1.39 U2.39 24.38,19.3 24.89,18.8 34.04,18.8 38.1,22.86 38.1,25.65 41.66,29.21 AL1.7 AL2.0
D8/A2
  Top 0.254: U1.38 23.88,25.2 23.58,24.91 U2.38 23.58,18.83 24.64,17.78 34.04,17.78 38.86,22.61 38.86,23.88 40.39,25.4 42.42,25.4 AH1.0 AH2.7
D9/A1
  Top 0.254: U1.37 23.38,25.49 22.78,24.89 U2.37 22.78,18.11 23.88,17.02 34.54,17.02 40.39,22.86 42.42,22.86 AH1.1 AH2.6
D10/A0
  Top 0.254: U1.36 22.88,25.78 21.98,24.88 U2.36 21.98,17.39 23.11,16.26 36.32,16.26 40.39,20.32 42.42,20.32 AH1.2 AH2.5
D11*
  Top 0.254: U1.30 19.9,28.97 19.3,28.37 U2.30 16.69,28.37 14.48,26.16 14.48,18.29 18.8,13.97 AH1.5 AH2.2
D12*  (via drill 0.38)
  Top 0.254: U1.29 19.62,29.47 19.32,29.17 U2.29 14.52,29.17 v14.48,28.96 | AL1.3 AL2.4
  Bottom 0.254: v14.48,28.96 12.95,29.21 12.19,29.97 12.19,34.54 17.02,39.37 24.38,39.37 25.65,40.64 42.42,40.64 AL1.3
D13*  (via drill 0.38)
  Top 0.254: U1.27 19.62,30.47 19.32,30.77 U2.27 17.69,30.77 17.55,30.63 14.83,30.63 v14.48,30.99 14.69,30.77 | AL1.4 AL2.3
  Bottom 0.254: AL1.4 40.89,36.83 37.85,39.88 26.16,39.88 24.89,38.61 18.03,38.61 14.48,35.05 v14.48,30.99
D14  (via drill 0.38)
  Top 0.254: AH1.6 AH2.1 | v30.48,24.64 30.48,25.68 U2.1
  Top 0.305: U1.1 27.9,27.47 29.4,25.97 U2.1
  Bottom 0.254: AH1.6 v30.48,24.64
D15
  Top 0.254: U1.28 U2.28 13.97,29.97 13.46,29.46 13.46,18.03 18.29,13.21 41.4,13.21 42.42,12.19 42.42,10.67 43.69,9.4 AH1.7 AH2.0
D+
  Top 0.254: R5.1 7.13,21.35 7.62,21.84 10.92,21.84 11.18,22.1 11.18,27.43 10.67,27.94 CONN2.D+
D-
  Top 0.254: CONN2.D- 10.2,28.74 12.45,30.99 12.45,33.26 R4.1
GND  (via drill 0.38, 0.61)
  Top 0.254: U1.23 19.61,33.97 U2.23 | U2.15 25.98,36.91 28.19,39.12 28.7,39.12 C3.1 28.96,39.24 C2.2 | U4.2 v14.22,38.1 | C4.2 29.84,42.29 v28.7,43.43
  Top 0.279: U2.15 25.98,34.85 25.38,34.25 U1.15 25.38,30.97 | 22.38,27.97 U1.35 22.38,26.07 21.18,24.87 U2.35 | 21.73,32.47 U1.23
  Top 0.305: U2.P$1 25.38,30.97 | 22.38,27.97 U2.P$1 | 21.73,32.47 22,32.21 22.15,32.21 U2.P$1 | U2.P$1 26.29,28.07 | C1.2 19.56,19.81 v18.92,19.18 17.53,20.57 R7.1 | v28.7,43.43 28.45,43.19 Y1.4 26.59,42.57 26.59,42.24 25.36,41.01 Y1.2 | C4.2 C2.2 | C5.2 34.54,38.61 v33.91,37.97
  Top 0.406: v8.89,44.2 9.01,44.07 C12.1 10.8,43.69 U3.2 12.95,43.66 14.22,43.66 | CONN2.GND 8.95,25.46 v8.89,25.4 | S1.3 9.1,36.36 v9.4,36.07 | C8.2 11.94,35.81 v11.68,36.07 | C11.1 13.46,41.15 14.22,41.91 14.22,43.66 | v14.22,38.1 18,38.1 C10.1 C9.1 | R13.1 16.98,42.84 16.15,43.66 14.22,43.66
  Top 0.61: JP6.1 76.47,17.51 v76.45,17.53 | v33.78,51.82 27.18,51.82 v26.92,52.07 | v24.89,6.35 25.65,6.35 v27.18,4.83
  Bottom 0.305: v28.7,43.43 28.96,43.43
  Bottom 0.406: v8.89,25.4 v9.65,25.4 10.16,25.4 | v9.4,36.07 9.65,36.07 | v11.68,36.07 11.43,36.07 | R3.1 R2.2 38.61,27.68 38.61,26.67 37.34,26.67 R3.1
  Bottom 0.61: v76.45,17.53 76.71,17.53 | v27.18,4.83 27.18,4.57 | v24.89,6.35 24.38,6.35
  pour Bottom: 0,7.62 0,48.26 7.62,48.26 7.62,56.39 81.28,56.39 81.28,48.26 90.17,48.26 90.17,7.62 81.28,7.62 81.28,-0.51 8.89,-0.51 8.89,7.62
HWB
  Top 0.254: U1.33 20.77,27.47 19.27,25.97 U2.33 18.52,25.91
  Top 0.406: R7.2 17.53,24.91 U2.33
I2C-SCL  (via drill 0.38)
  Top 0.254: U1.18 23.88,34.61 23.58,34.91 U2.18 23.58,43.65 v23.62,43.69 | BUS2.7 R9.1 23.37,9.4 | BUS1.7 4.57,7.37 5.59,7.37 10.92,2.03 20.83,2.03 23.37,4.57 BUS2.7 | v83.06,33.53 83.06,43.18 BUS4.7 | v39.88,4.32 40.13,4.32 41.4,3.05 64.01,3.05 v65.02,4.06 | v68.58,49.02 v73.66,49.02 | v37.34,4.32 36.32,4.32 35.81,4.83 28.7,4.83 26.16,7.37 24.89,7.37 BUS2.7
  Bottom 0.254: v23.62,43.69 24.64,44.7 24.64,48.01 30.23,53.59 59.94,53.59 BUS3.7 v68.58,49.02 | v65.02,4.06 80.77,4.06 83.06,6.35 v83.06,33.53 | v37.34,4.32 v39.88,4.32 | v73.66,49.02 84.84,49.02 BUS4.7
I2C-SDA  (via drill 0.38)
  Top 0.254: U1.19 23.38,34.38 22.78,34.98 U2.19 22.78,40.56 v22.78,40.64 | R8.1 BUS2.6 29.21,5.59 v37.34,5.59 | BUS1.6 5.59,8.38 10.69,3.28 v17.53,3.28 | v39.88,5.59 59.82,5.59 v60.22,5.99 | v60.2,20.32 60.2,33.53 v64.01,37.34 v64.01,43.69
  Bottom 0.254: v22.78,40.64 23.37,40.64 27.18,44.45 27.18,49.53 30.48,52.83 58.17,52.83 BUS3.6 v64.01,43.69 | BUS2.6 25.91,4.22 24.97,3.28 v17.53,3.28 | BUS4.6 84.33,39.62 82.04,37.34 v64.01,37.34 | v37.34,5.59 v39.88,5.59 | v60.22,5.99 60.22,20.3 v60.2,20.32
N$1
  Top 0.406: U4.3 9.87,37.15 S1.2
N$4
  Top 0.406: LED1.A R12.1
N$5
  Top 0.406: LED1.C 2.81,45.48 3.05,45.72 11.84,45.72 U3.1
N$6
  Top 0.254: U3.5 16.66,44.64 R13.2
N$8
  Top 0.406: U4.4 15.52,36.26 C8.1
RD+  (via drill 0.38)
  Top 0.254: U1.4 28.81,28.97 29.41,28.37 U2.4 31.83,28.37 v31.75,28.19 | v10.16,19.05 10.16,19.8 R5.2
  Bottom 0.254: v10.16,19.05 12.19,21.08 12.19,25.4 15.49,28.7 15.49,34.8 18.54,37.85 25.65,37.85 26.92,39.12 30.99,39.12 31.75,38.1 v31.75,28.19
RD-  (via drill 0.38)
  Top 0.254: U1.3 28.58,28.47 29.48,27.57 U2.3 31.23,27.57 31.62,27.18 v32.13,27.18 | v18.29,36.32 17.51,36.32 R4.2
  Bottom 0.254: v18.29,36.32 19.05,37.08 29.72,37.08 30.73,36.07 30.73,27.69 31.24,27.18 v32.13,27.18
RESET
  Top 0.254: U1.13 26.38,33.77 27.58,34.98 U2.13 27.58,36.73 27.94,37.08 30.48,37.08 30.99,36.58 35.56,36.58 36.32,37.34 D2.A
  Top 0.406: R6.1 38.61,38.61 38.35,38.35 36.4,38.35 D2.A
SPI-CS1
  Top 0.254: U1.25 20.24,31.47 19.34,32.37 U2.25 14.59,32.37 11.94,29.72 11.94,9.91 12.95,8.89 BUS1.3
SPI-CS2  (via drill 0.38)
  Top 0.254: U1.26 19.95,30.97 19.36,31.57 U2.26 18.51,31.5 v17.02,31.5
  Bottom 0.254: BUS2.3 25.91,16.51 15.75,16.51 14.99,17.27 14.99,26.92 16.51,28.45 16.51,30.99 v17.02,31.5
SPI-CS3  (via drill 0.38)
  Top 0.254: U1.8 28.81,30.97 29.41,31.57 U2.8 39.19,31.57 v40.39,32.77 | v51.82,33.02 53.09,33.02 54.61,34.54 54.61,38.1 v55.12,38.61
  Bottom 0.254: v40.39,32.77 40.64,33.02 v51.82,33.02 | BUS3.3 55.24,45.85 55.12,45.72 v55.12,38.61
SPI-CS4
  Top 0.254: BUS4.3 76.71,48.26 71.12,53.85 25.15,53.85 19.56,48.26 19.56,45.47 20.55,44.48 20.55,36.83 20.38,36.66 U2.22 | 20.32,35.84 U2.22 | U2.22 20.38,34.23 21.34,33.27 21.86,33.27 U1.22
SPI-MISO  (via drill 0.38)
  Top 0.254: U1.11 27.85,32.47 29.36,33.98 U2.11 34.99,33.97 v35.56,34.54 | BUS1.0 20.83,5.33 v21.08,5.08 | v24.89,5.08 26.92,3.05 36.83,3.05 v37.08,3.3 | v67.56,35.56 67.56,38.61 70.36,41.4 70.36,45.72 BUS4.0 67.06,49.02 67.06,49.78 64.77,52.07 53.85,52.07 BUS3.0
  Bottom 0.254: v21.08,5.08 v24.89,5.08 | v37.08,3.3 40.39,3.3 | 40.39,3.3 41.15,4.06 BUS2.0 | v35.56,34.54 41.15,34.54 42.16,35.56 49.53,35.56 50.29,36.32 50.29,39.62 47.5,42.42 47.5,45.72 BUS3.0 | v67.56,35.56 65.28,33.27 65.28,7.62 64.01,6.35 62.23,6.35 60.96,5.08 45.72,5.08 43.94,3.3 40.39,3.3
SPI-MOSI  (via drill 0.38)
  Top 0.254: U1.10 28.19,31.97 29.36,33.15 U2.10 37.49,33.17 42.42,38.1 46.74,38.1 50.04,41.4 50.04,45.72 BUS3.1 52.83,48.51 57.4,48.51 57.66,48.26 57.66,45.97 58.42,45.21 v67.31,45.21 | v24.38,4.06 26.16,2.29 37.59,2.29 | 37.59,2.29 38.61,3.3 BUS2.1 | 37.59,2.29 65.28,2.29 70.36,7.37 70.36,27.94 72.9,30.48 72.9,45.72 BUS4.1
  Bottom 0.254: BUS1.1 18.29,5.08 19.3,4.06 v24.38,4.06 | v67.31,45.21 67.56,45.21 68.07,45.72 70.36,45.72 BUS4.1
SPI-SCK  (via drill 0.38)
  Top 0.254: U1.9 28.48,31.47 29.38,32.37 U2.9 38.21,32.37 41.4,35.56 50.55,35.56 52.58,37.59 52.58,45.72 BUS3.2 | v57.4,50.8 v64.26,50.8 | BUS2.2 36.07,7.11 36.32,6.86 v37.08,6.86 | v68.33,32 67.82,31.5 67.82,7.87 66.8,6.86 v39.88,6.86 | v75.44,33.78 75.44,45.72 BUS4.2
  Bottom 0.254: BUS2.2 36.07,3.76 34.8,2.49 16.82,2.49 15.75,3.56 BUS1.2 | v37.08,6.86 v39.88,6.86 | v68.33,32 73.66,32 v75.44,33.78 | v64.26,50.8 70.36,50.8 BUS4.2 | BUS3.2 53.85,48.77 55.88,50.8 v57.4,50.8
UCAP
  Top 0.254: U1.6 U2.6
  Top 0.406: U2.6 33.4,29.97 C7.1
UGND  (via drill 0.61)
  Top 0.254: U2.5 29.4,29.17 29.1,29.47 U1.5
  Top 0.406: v36.7,29.72 C7.2 35.18,29.96 35.18,28.96 34.72,28.5 33.35,28.5 32.68,29.17 U2.5
  Bottom 0.406: R3.2 37.34,28.57 36.58,29.34 v36.7,29.72
V_BATT  (via drill 0.38, 0.61)
  Top 0.406: U3.3 11.88,42.74 C12.2
  Top 0.61: JP6.2 78.47,11.16 77.98,10.67 75.18,10.67 | 75.18,10.67 73.66,10.67 v72.39,11.94 | v66.55,11.94 61.47,11.94 57.29,16.12 D1.A | C12.2 10.41,40.39 v11.25,39.98 | v75.44,2.79 75.44,10.41 75.18,10.67
  Bottom 0.61: v72.39,11.94 v66.55,11.94 | v75.44,2.79 73.66,1.52 14.99,1.52 14.22,1.78 14.22,5.59 12.7,7.11 7.87,7.11 6.86,8.13 6.86,10.92 5.08,12.7 5.08,20.07 2.79,22.35 2.79,34.8 3.3,35.31 6.86,35.31 7.62,36.07 7.62,36.35 v11.25,39.98
XTAL1
  Top 0.254: U1.17 U2.17
  Top 0.305: U2.17 24.38,38.21 R1.1 25.02,38.86 24.38,39.5 24.38,42.67 24.9,43.19 Y1.1 25.4,43.22 25.4,44.2 25.65,44.45 29.72,44.45 30.1,44.07 C4.1
XTAL2
  Top 0.254: U1.16 24.88,34.61 25.18,34.91 U2.16
  Top 0.305: U2.16 25.18,37.74 R1.2 26.94,39.26 26.94,40.61 Y1.3 27.21,41.02 C3.2

### Text on the board
tPlace: ON | CHG | + | -
Document: TODO: Analog?